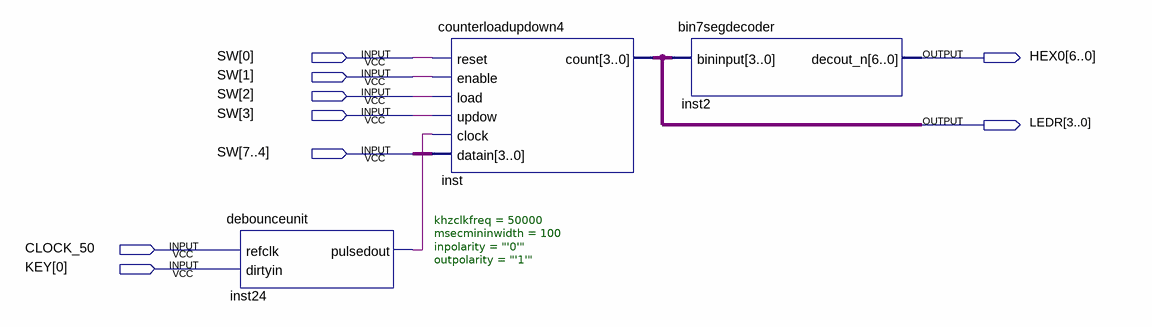
[diagram p0: schematic sheet]
// Quartus schematic LoadCounter_Demo.bdf as structural Verilog: 3 symbols, 9 pins
module LoadCounter_Demo (
  input  [7:0] SW,
  input  CLOCK_50,
  input  [0:0] KEY,
  output [6:0] HEX0,
  output [3:0] LEDR
);

  wire inst24_pulsedout;

  debounceunit #(.khzclkfreq(50000), .msecmininwidth(100), .inpolarity("'0'"), .outpolarity("'1'")) inst24 (
    .refclk(CLOCK_50), .dirtyin(KEY[0]), .pulsedout(inst24_pulsedout));
  counterloadupdown4 inst (
    .reset(SW[0]), .enable(SW[1]), .load(SW[2]), .updow(SW[3]), .clock(inst24_pulsedout), .datain(SW[7:4]),
    .count(LEDR));
  bin7segdecoder inst2 (.bininput(LEDR), .decout_n(HEX0));
endmodule
